# Altium project audiobound.PrjPcb
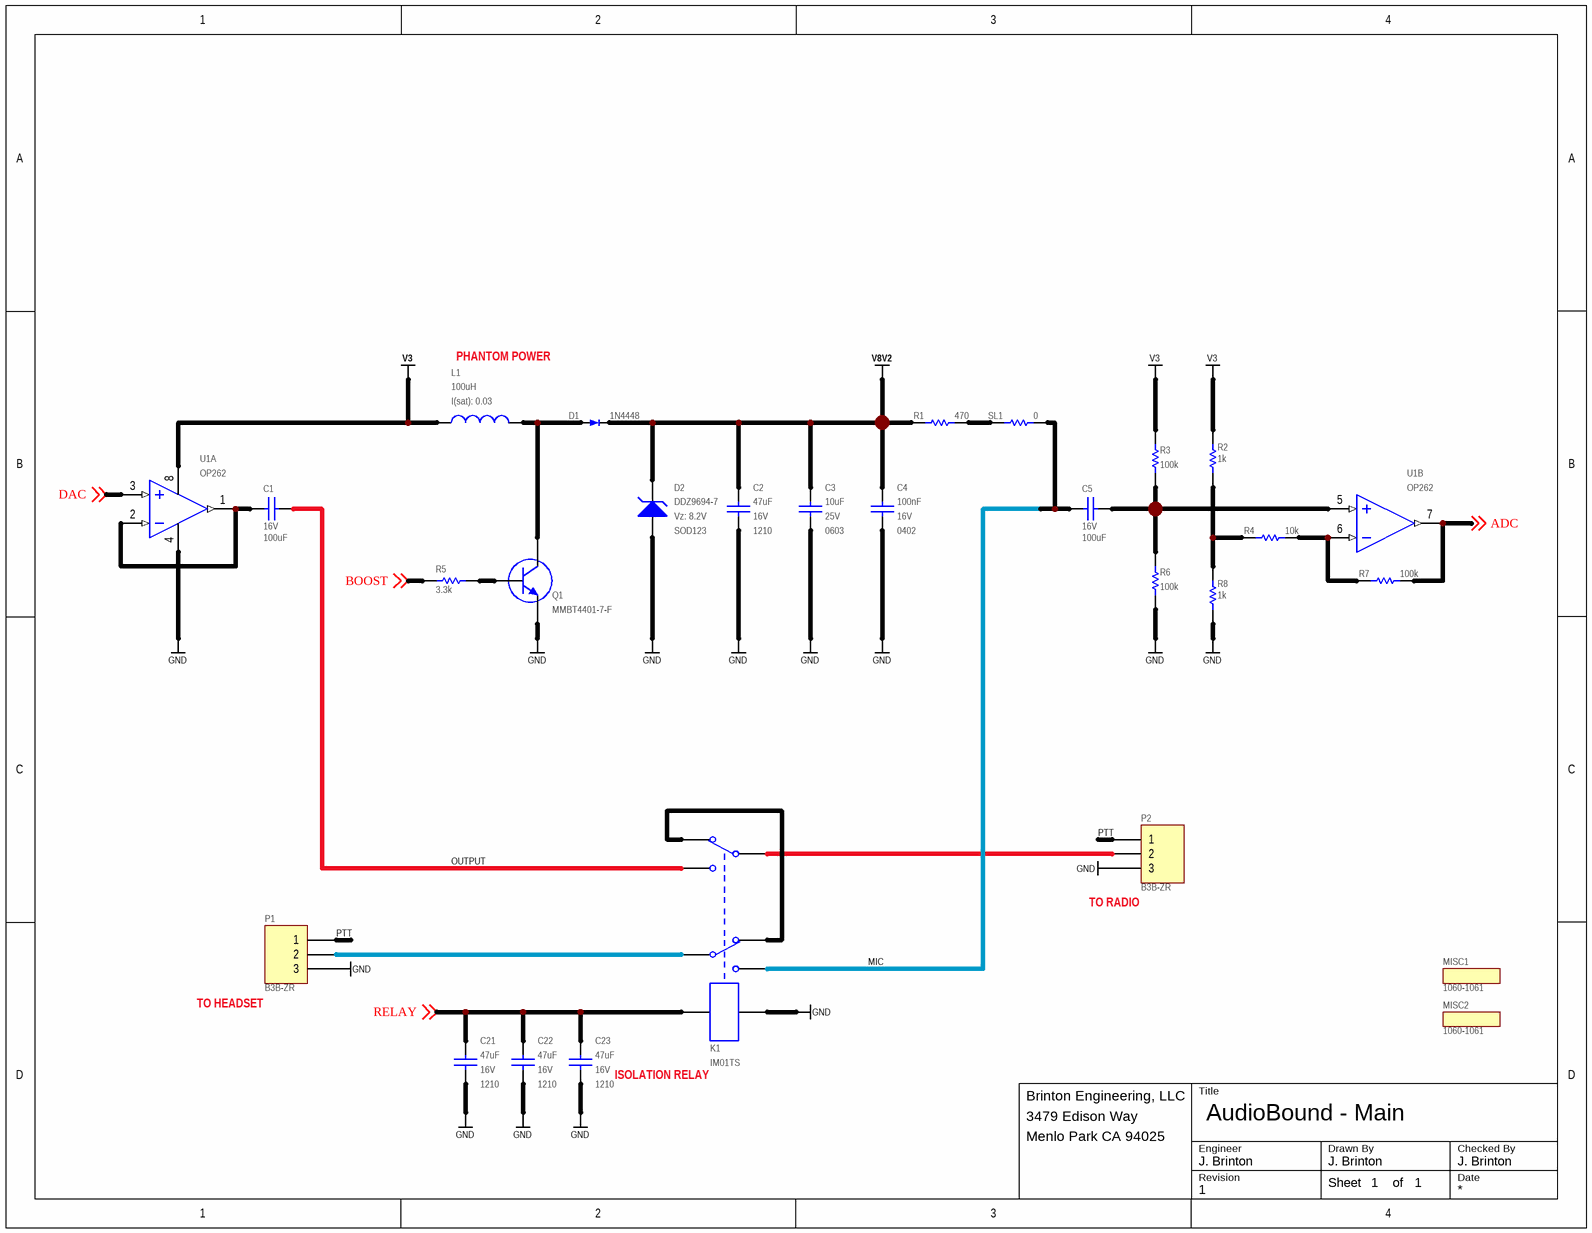
[diagram p0: main.SchDoc]
3 sheets, 81 parts. Net scope: global (net labels, ports and power ports of the same name join across sheets).
Board file: audiobound.PcbDoc
Sheets:
  main.SchDoc
  mcu.SchDoc
  power.SchDoc

## Sheet main.SchDoc: AudioBound - Main
size Letter; CheckedBy: J. Brinton; CompanyName: Brinton Engineering, LLC; DrawnBy: J. Brinton; Engineer: J. Brinton; Address1: 3479 Edison Way; Address2: Menlo Park CA 94025; Revision: 1; SheetNumber: 1; SheetTotal: 1

### Parts
C1  value 100uF  Voltage: 16V  [CAPC7563X300L40N]  (hidden comment: C7563X7S1C107M280LE)
C2  value 47uF  Voltage: 16V  [1210]  (hidden comment: GRM32EC81C476KE15L)
C3  value 10uF  Voltage: 25V  [0603]  (hidden comment: CL10A106MA8NRNC)
C4  value 100nF  Voltage: 16V  [0402]  (hidden comment: GRM155R71C104KA88J)
C5  value 100uF  Voltage: 16V  [CAPC7563X300L40N]  (hidden comment: C7563X7S1C107M280LE)
C21  value 47uF  Voltage: 16V  [1210]  (hidden comment: GRM32EC81C476KE15L)
C22  value 47uF  Voltage: 16V  [1210]  (hidden comment: GRM32EC81C476KE15L)
C23  value 47uF  Voltage: 16V  [1210]  (hidden comment: GRM32EC81C476KE15L)
D1  Alternative P/N: 1N4448  [SOD323]  (hidden comment: 1N4448HWS-7-F)
D2  DDZ9694-7  Vz: 8.2V  [SOD123]
K1  IM01TS  [IM01TS]
L1  value 100uH  I(sat): 0.03  [0805]  (hidden comment: KLZ2012NHR101LTD25)
MISC1  1060-1061  (mechanical)
MISC2  1060-1061  (mechanical)
P1  B3B-ZR  [B3B-ZR]  (no BOM)
P2  B3B-ZR  [B3B-ZR]  (no BOM)
Q1  MMBT4401-7-F  [SOT23]
R1  value 470  [RESC1005X40N]  (hidden comment: ERJ-2RKF4700X)
R2  value 1k  [RESC1005X40N]  (hidden comment: ERJ-2RKF1001X)
R3  value 100k  [RESC1005X40N]  (hidden comment: ERJ-2RKF1003X)
R4  value 10k  [RESC1005X40N]  (hidden comment: ERJ-2RKF1002X)
R5  value 3.3k  [RESC1005X40N]  (hidden comment: ERJ-2RKF3301X)
R6  value 100k  [RESC1005X40N]  (hidden comment: ERJ-2RKF1003X)
R7  value 100k  [RESC1005X40N]  (hidden comment: ERJ-2RKF1003X)
R8  value 1k  [RESC1005X40N]  (hidden comment: ERJ-2RKF1001X)
SL1  value 0  [SOLDERLINK0603X26N_BRIDGED]  (hidden comment: SOLDER_LINK_BRIDGED)  (no BOM)
U1  OP262  [TSSOP8]  (parts A,B of 2)

### Nets
GND: C2.1 C3.1 C4.2 C21.1 C22.1 C23.1 D2.1(A) K1.8 P1.3 P2.3 Q1.2(E) R6.1 R8.1 U1.4(V-)
V3: L1.1 R2.2 R3.2 U1.8(V+)
V8V2: C2.2 C3.2 C4.1 D1.K D2.2(C) R1.2
ADC: R7.1 U1.7(OUTB) ; off-sheet ADC
BOOST: R5.2 ; off-sheet BOOST
DAC: U1.3(INA+) ; off-sheet DAC
MIC: C5.2 K1.4 SL1.2
OUTPUT: C1.1 K1.5
PTT: P1.1 P2.1
RELAY: C21.2 C22.2 C23.2 K1.1 ; off-sheet RELAY
NetC1_2: C1.2 U1.1(OUTA) U1.2(INA-)
NetC5_1: C5.1 R3.1 R6.2 U1.5(INB+)
NetD1_A: D1.A L1.2 Q1.3(C)
NetK1_2: K1.2 K1.7
NetK1_3: K1.3 P1.2
NetK1_6: K1.6 P2.2
NetQ1_1: Q1.1(B) R5.1
NetR1_1: R1.1 SL1.1
NetR2_1: R2.1 R4.2 R8.2
NetR4_1: R4.1 R7.2 U1.6(INB-)

### Notes on the sheet
- PHANTOM POWER
- (near P2) TO RADIO
- (near P1) TO HEADSET
- ISOLATION RELAY
- Title
- Engineer
- Revision
- Drawn By
- Checked By
- Date
- Sheet
- of

### Library data of the parts
C1 C5 = CAP: Ceramic Capacitor 100uF ±20% 16V X7S 3025; Manufacturer: TDK; Tr: -55:125; Manufacturer P/N: C7563X7S1C107M280LE; Tolerance: ±20%; Package: 3025
C2 C21-C23 = CAP: Ceramic Capacitor 47uF ±10% 16V X6S 1210; Manufacturer: Murata; Tr: -55:105; Manufacturer P/N: GRM32EC81C476KE15L; Tolerance: ±10%; Footprint: *; Package: 1210
C3 = CAP 0603: Ceramic Capacitor 10uF ±20% 25V X5R 0603; Manufacturer: Samsung; Tr: -55:85; Manufacturer P/N: CL10A106MA8NRNC; Package: 0603; Tolerance: ±20%
C4 = CAP 0402: Ceramic Capacitor 100nF ±10% 16V X7R 0402; Manufacturer: Murata; Tr: -55:125; Manufacturer P/N: GRM155R71C104KA88J; Package: 0402; Tolerance: ±10%
D1 = 1N4448HWS-7-F: Schottky Diode 80V 250mA SOD323; Manufacturer: Diodes, Inc.; Manufacturer P/N: 1N4448HWS-7-F
D2 = DDZ9694-7: Zener Diode 8.2V 500mW SOD123; Manufacturer: Diodes, Inc.; Manufacturer P/N: DDZ9694-7; Package: SOD123
K1 = IM01TS: Dual-Pole Dual-Throw Relay; Manufacturer: TE Connectivity; Manufacturer: IM01TS
L1 = INDUCTOR: Inductor 100uH ±20% 140mA 0805; Manufacturer: TDK; Tr: -55:150; Manufacturer P/N: KLZ2012NHR101LTD25; Package: 0805; Tolerance: ±20%
MISC1 MISC2 = M50-1900005: Strain Relief Bushing; Manufacturer: Heyco; Do Not Place: PURCHASE BUT DNP; Manufacturer P/N: 1060-1061
P1 P2 = Header 3: Header, 3-Pin; Manufacturer: JST; Manufacturer P/N: B3B-ZR
Q1 = MMBT4401-7-F: NPN Small Signal Transistor SMD SOT-23; Manufacturer: Diodes, Inc.; Manufacturer P/N: MMBT4401-7-F
R1 = RES: Thick Film Resistor 470 ±1% 0.1W 50V 0402; Manufacturer: Panasonic; Tcr: ±100; Tr: -55:155; Voltage: 50; Power: 0.1; Manufacturer P/N: ERJ-2RKF4700X; Tolerance: ±1%; Alternatives: *; Footprint: *; Package: 0402
R2 R8 = RES: Thick Film Resistor 1k ±1% 0.1W 50V 0402; Manufacturer: Panasonic; Tcr: ±100; Tr: -55:155; Voltage: 50; Power: 0.1; Manufacturer P/N: ERJ-2RKF1001X; Tolerance: ±1%; Alternatives: *; Footprint: *; Package: 0402
R3 R6 R7 = RES: Thick Film Resistor 100k ±1% 0.1W 50V 0402; Manufacturer: Panasonic; Tcr: ±100; Tr: -55:155; Voltage: 50; Power: 0.1; Manufacturer P/N: ERJ-2RKF1003X; Tolerance: ±1%; Alternatives: *; Footprint: *; Package: 0402
R4 = RES: Thick Film Resistor 10k ±1% 0.1W 50V 0402; Manufacturer: Panasonic; Tcr: ±100; Tr: -55:155; Voltage: 50; Power: 0.1; Manufacturer P/N: ERJ-2RKF1002X; Tolerance: ±1%; Alternatives: *; Footprint: *; Package: 0402
R5 = RES: Thick Film Resistor 3.3k ±1% 0.1W 50V 0402; Manufacturer: Panasonic; Tcr: ±100; Tr: -55:155; Voltage: 50; Power: 0.1; Manufacturer P/N: ERJ-2RKF3301X; Tolerance: ±1%; Alternatives: *; Footprint: *; Package: 0402
SL1 = RES: Solder Link Bridged; Manufacturer P/N: *; Manufacturer: *
U1 = OP262: Dual 15 MHz Rail-to-Rail Op Amp; Manufacturer P/N: OP262HRU; Manufacturer: Analog Devices

## Sheet mcu.SchDoc: AudioBound - MCU
size Letter; CheckedBy: J. Brinton; CompanyName: Brinton Engineering, LLC; DrawnBy: J. Brinton; Engineer: J. Brinton; Address1: 3479 Edison Way; Address2: Menlo Park CA 94025; Revision: 1; SheetNumber: 2; SheetTotal: 2
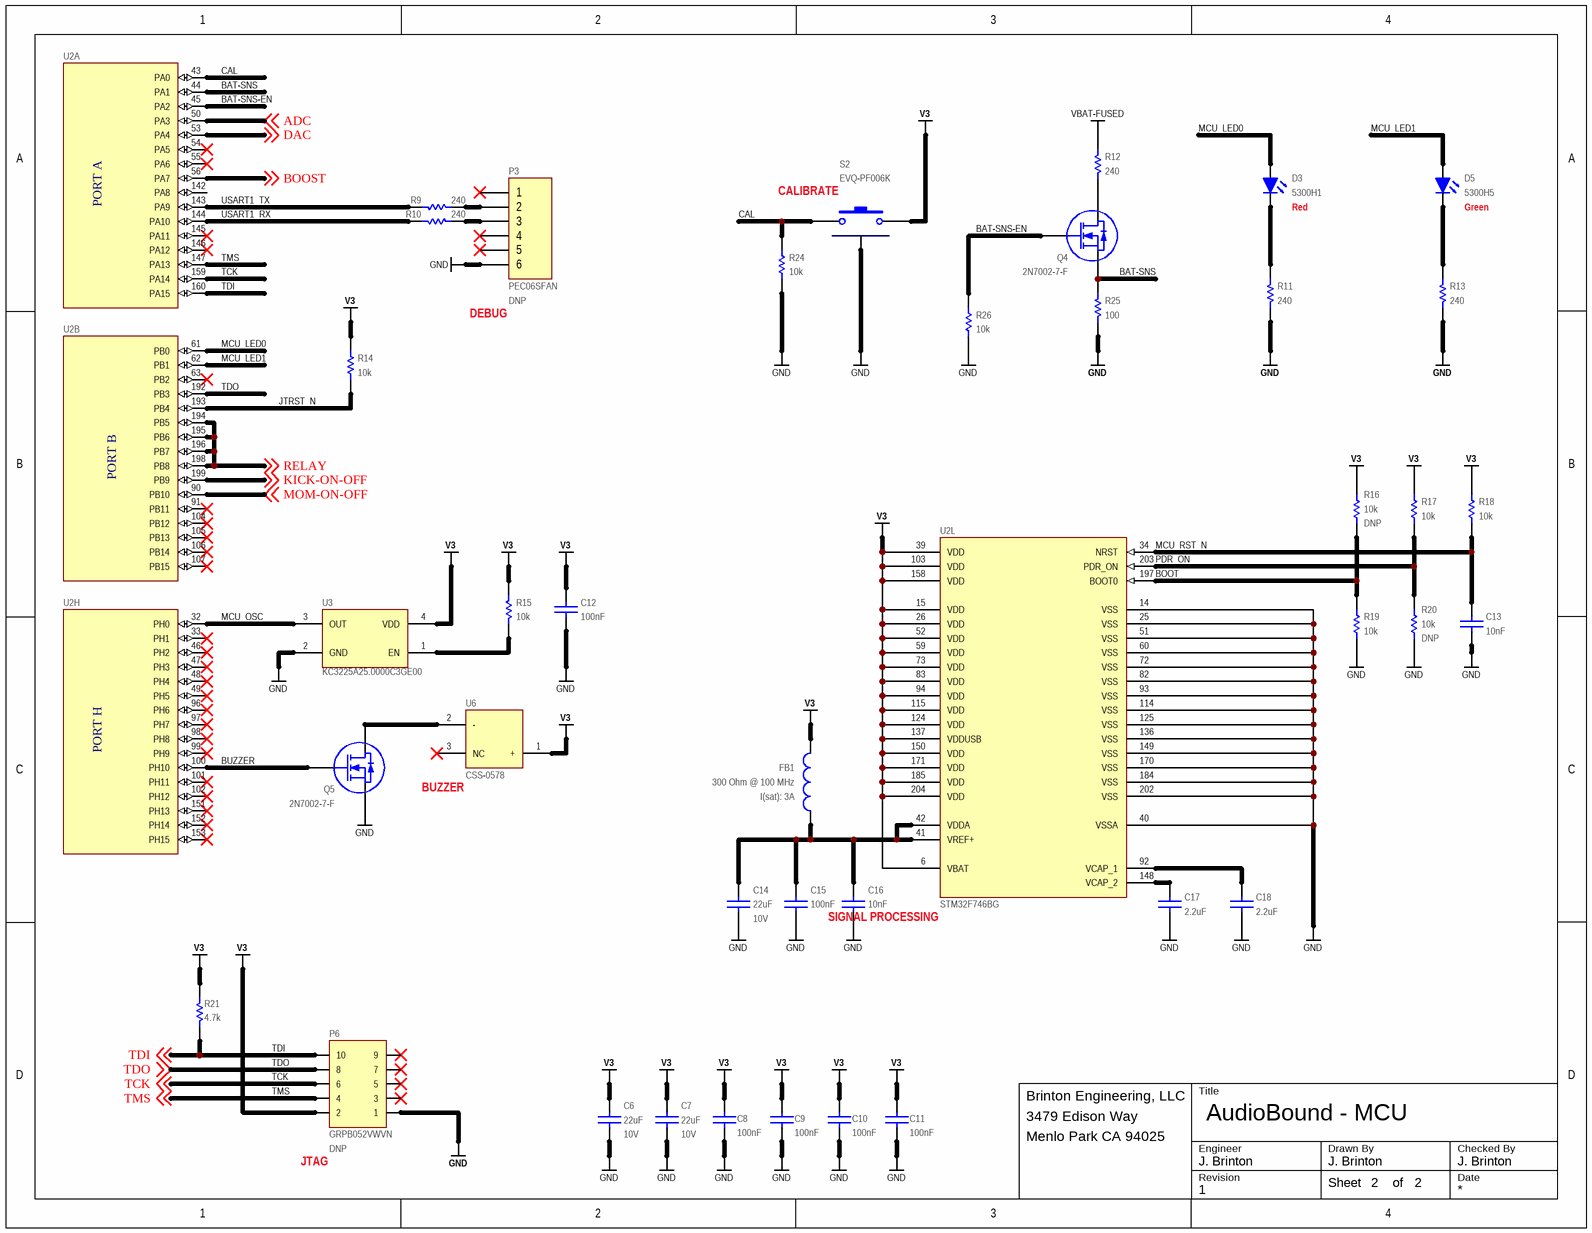
[diagram p1: mcu.SchDoc]

### Parts
C6  value 22uF  Voltage: 10V  [CAPC200X125X145L45N]  (hidden comment: C2012X7S1A226M125)
C7  value 22uF  Voltage: 10V  [CAPC200X125X145L45N]  (hidden comment: C2012X7S1A226M125)
C8  value 100nF  [CAPC100X50X55L25N]  (hidden comment: GCM155R71H104KE02)
C9  value 100nF  [CAPC100X50X55L25N]  (hidden comment: GCM155R71H104KE02)
C10  value 100nF  [CAPC100X50X55L25N]  (hidden comment: GCM155R71H104KE02)
C11  value 100nF  [CAPC100X50X55L25N]  (hidden comment: GCM155R71H104KE02)
C12  value 100nF  [CAPC100X50X55L25N]  (hidden comment: GCM155R71H104KE02)
C13  value 10nF  [CAPC100X50X55L25N]  (hidden comment: GRM155R71H103KA88)
C14  value 22uF  Voltage: 10V  [CAPC200X125X145L45N]  (hidden comment: C2012X7S1A226M125)
C15  value 100nF  [CAPC100X50X55L25N]  (hidden comment: GCM155R71H104KE02)
C16  value 10nF  [CAPC100X50X55L25N]  (hidden comment: GRM155R71H103KA88)
C17  value 2.2uF  [CAPC160X80X90L20N]  (hidden comment: C1608X7R1A225M080)
C18  value 2.2uF  [CAPC160X80X90L20N]  (hidden comment: C1608X7R1A225M080)
D3  5300H1  [5300Hx]
D5  5300H5  [5300Hx]
FB1  value 300 Ohm @ 100 MHz  I(sat): 3A  [0805]  (hidden comment: 742792031)
P3  PEC06SFAN  Do Not Place: DNP  [HDR1X6]
P6  GRPB052VWVN  Do Not Place: DNP  [GRPB052VWVN]
Q4  2N7002-7-F  [SOT23]
Q5  2N7002-7-F  [SOT23]
R9  value 240  [RESC1005X40N]  (hidden comment: ERJ-2RKF2400X)
R10  value 240  [RESC1005X40N]  (hidden comment: ERJ-2RKF2400X)
R11  value 240  [RESC1005X40N]  (hidden comment: ERJ-2RKF2400X)
R12  value 240  [RESC1005X40N]  (hidden comment: ERJ-2RKF2400X)
R13  value 240  [RESC1005X40N]  (hidden comment: ERJ-2RKF2400X)
R14  value 10k  [RESC1005X40N]  (hidden comment: ERJ-2RKF1002X)
R15  value 10k  [RESC1005X40N]  (hidden comment: ERJ-2RKF1002X)
R16  value 10k  Do Not Place: DNP  [RESC1005X40N]  (hidden comment: ERJ-2RKF1002X)
R17  value 10k  [RESC1005X40N]  (hidden comment: ERJ-2RKF1002X)
R18  value 10k  [RESC1005X40N]  (hidden comment: ERJ-2RKF1002X)
R19  value 10k  [RESC1005X40N]  (hidden comment: ERJ-2RKF1002X)
R20  value 10k  Do Not Place: DNP  [RESC1005X40N]  (hidden comment: ERJ-2RKF1002X)
R21  value 4.7k  [RESC1005X40N]  (hidden comment: ERJ-2RKF4701X)
R24  value 10k  [RESC1005X40N]  (hidden comment: ERJ-2RKF1002X)
R25  value 100  [RESC1005X40N]  (hidden comment: ERJ-2RKF1000X)
R26  value 10k  [RESC1005X40N]  (hidden comment: ERJ-2RKF1002X)
S2  EVQ-PF006K  [EVQ-PF006K]
U2  STM32F746BG  [LQFP208]  (value not drawn)  (parts A,B,H,L of 12)
U3  KC3225A25.0000C3GE00  [OSCCC320X250X80L75X100N]
U6  CSS-0578  [CSS-0578]

### Nets
GND: C6.2 C7.2 C8.1 C9.1 C10.1 C11.1 C12.1 C13.1 C14.2 C15.1 C16.1 C17.1 C18.1 P3.6 P6.1 Q5.2(S) R11.2 R13.2 R19.1 R20.1 R24.2 R25.2 R26.2 S2.3 U2.14(VSS) U2.25(VSS) U2.40(VSSA) U2.51(VSS) U2.60(VSS) U2.72(VSS) U2.82(VSS) U2.93(VSS) U2.114(VSS) U2.125(VSS) U2.136(VSS) U2.149(VSS) U2.170(VSS) U2.184(VSS) U2.202(VSS) U3.2(GND)
V3: C6.1 C7.1 C8.2 C9.2 C10.2 C11.2 C12.2 FB1.2 P6.2 R14.2 R15.2 R16.2 R17.2 R18.2 R21.2 S2.2 U2.6(VBAT) U2.15(VDD) U2.26(VDD) U2.39(VDD) U2.52(VDD) U2.59(VDD) U2.73(VDD) U2.83(VDD) U2.94(VDD) U2.103(VDD) U2.115(VDD) U2.124(VDD) U2.137(VDDUSB) U2.150(VDD) U2.158(VDD) U2.171(VDD) U2.185(VDD) U2.204(VDD) U3.4(VDD) U6.1(+)
VBAT-FUSED: R12.1
ADC: U2.50(PA3) ; off-sheet ADC
BAT-SNS: Q4.2(S) R25.1 U2.44(PA1)
BAT-SNS-EN: Q4.1(G) R26.1 U2.45(PA2)
BOOST: U2.56(PA7) ; off-sheet BOOST
BOOT: R16.1 R19.2 U2.197(BOOT0)
BUZZER: Q5.1(G) U2.100(PH10)
CAL: R24.1 S2.1 U2.43(PA0)
DAC: U2.53(PA4) ; off-sheet DAC
JTRST_N: R14.1 U2.193(PB4)
KICK-ON-OFF: U2.199(PB9) ; off-sheet KICK-ON-OFF
MCU_LED0: D3.1(A) U2.61(PB0)
MCU_LED1: D5.1(A) U2.62(PB1)
MCU_OSC: U2.32(PH0) U3.3(OUT)
MCU_RST_N: C13.2 R18.1 U2.34(NRST)
MOM-ON-OFF: U2.90(PB10) ; off-sheet MOM-ON-OFF
PDR_ON: R17.1 R20.2 U2.203(PDR_ON)
RELAY: U2.194(PB5) U2.195(PB6) U2.196(PB7) U2.198(PB8) ; off-sheet RELAY
TCK: P6.6 U2.159(PA14) ; off-sheet TCK
TDI: P6.10 R21.1 U2.160(PA15) ; off-sheet TDI
TDO: P6.8 U2.192(PB3) ; off-sheet TDO
TMS: P6.4 U2.147(PA13) ; off-sheet TMS
USART1_RX: R10.1 U2.144(PA10)
USART1_TX: R9.1 U2.143(PA9)
NetC14_1: C14.1 C15.2 C16.2 FB1.1 U2.41(VREF+) U2.42(VDDA)
NetC17_2: C17.2 U2.148(VCAP_2)
NetC18_2: C18.2 U2.92(VCAP_1)
NetD3_2: D3.2(K) R11.1
NetD5_2: D5.2(K) R13.1
NetP3_2: P3.2 R9.2
NetP3_3: P3.3 R10.2
NetQ4_3: Q4.3(D) R12.2
NetQ5_3: Q5.3(D) U6.2(-)
NetR15_1: R15.1 U3.1(EN)

Not connected (* = marked no-connect by the designer): P3 1* 4* 5*; P6 3* 5* 7* 9*; U2 33(PH1)* 46(PH2)* 47(PH3)* 48(PH4)* 49(PH5)* 54(PA5)* 55(PA6)* 63(PB2)* 91(PB11)* 96(PH6)* 97(PH7)* 98(PH8)* 99(PH9)* 101(PH11)* 102(PH12)* 104(PB12)* 105(PB13)* 106(PB14)* 107(PB15)* 142(PA8) 145(PA11)* 146(PA12)* 151(PH13)* 152(PH14)* 153(PH15)*; U6 3(NC)*

### Notes on the sheet
- (near S2) CALIBRATE
- (near D3) Red
- (near D5) Green
- (near P3) DEBUG
- (near U6) BUZZER
- (near U2) SIGNAL PROCESSING
- (near P6) JTAG
- Title
- Engineer
- Revision
- Drawn By
- Checked By
- Date
- Sheet
- of
- (in symbol STM32F746BGT6, part A) PORT A
- (in symbol STM32F746BGT6, part B) PORT B
- (in symbol STM32F746BGT6, part H) PORT H

### Library data of the parts
C6 C7 C14 = CAP: Ceramic Capacitor 22uF ±20% 10V X7S 0805; Manufacturer: TDK; Tr: -55:125; Manufacturer P/N: C2012X7S1A226M125; Tolerance: ±20%; Package: 0805
C8-C12 C15 = CAP: Ceramic Capacitor 100nF ±10% 50V X7R 0402; Manufacturer: Murata; Tr: -55:125; Voltage: 50V; Manufacturer P/N: GCM155R71H104KE02; Tolerance: ±10%; Footprint: *; Package: 0402
C13 C16 = CAP: Ceramic Capacitor 10nF ±10% 50V X7R 0402; Manufacturer: Murata; Tr: -55:125; Tolerance: ±10%; Manufacturer P/N: GRM155R71H103KA88; Voltage: 50V; Package: 0402
C17 C18 = CAP: Ceramic Capacitor 2.2uF ±20% 10V X7R 0603; Manufacturer: TDK; Tr: -55:125; Tolerance: ±20%; Manufacturer P/N: C1608X7R1A225M080; Package: 0603; Voltage: 10V
D3 = LED0603RD: LED, Color Red, 10mA, 2.0V; Manufacturer: Visual Communications Company; Manufacturer P/N: 5300H1
D5 = LED0603RD: LED, Color Green, 10mA, 2.2V; Manufacturer: Visual Communications Company; Manufacturer P/N: 5300H5
FB1 = INDUCTOR: Ferrite Chip 300 Ohm @ 100MHz; 3A; Manufacturer: Wurth Electronics, Inc; Manufacturer P/N: 742792031; Package: 0805
P3 = Header 6: Header, 6-Pin; Manufacturer: Sullins; Manufacture P/N: PEC06SFAN
P6 = GRPB052VWVN: Male Header, 0.050" Pitch, 2x5 Position, Right Angle; Manufacturer P/N: GRPB052MWCN; Manufacturer: Sullins
Q4 Q5 = 2N7002-7-F: N-Channel Enhancement Mode MOSFET; Manufacturer: Diodes, Inc.; Manufacturer P/N: 2N7002-7-F
R9-R13 = RES: Thick Film Resistor 240 ±1% 0.1W 75V 0402; Manufacturer: Panasonic; Tcr: ±100; Tr: -55:155; Voltage: 75; Power: 0.1; Tolerance: ±1%; Manufacturer P/N: ERJ-2RKF2400X; Alternatives: *; Footprint: *; Package: 0402
R14-R20 R24 R26 = RES: as R4 on sheet main; Manufacturer P/N: ERJ-2RKF1002X; Tolerance: ±1%; Alternatives: *; Footprint: *; Package: 0402
R21 = RES: Thick Film Resistor 4.7k ±1% 0.1W 75V 0402; Manufacturer: Panasonic; Tcr: ±100; Tr: -55:155; Voltage: 75; Power: 0.1; Tolerance: ±1%; Manufacturer P/N: ERJ-2RKF4701X; Alternatives: *; Footprint: *; Package: 0402
R25 = RES: Thick Film Resistor 100 ±1% 0.1W 75V 0402; Manufacturer: Panasonic; Tcr: ±100; Tr: -55:155; Voltage: 75; Power: 0.1; Tolerance: ±1%; Manufacturer P/N: ERJ-2RKF1000X; Alternatives: *; Footprint: *; Package: 0402
S2 = EVQ-PF006K: Tactile Switch; Normally Open; Manufacturer: Panasonic; Manufacturer P/N: EVQ-PF006K
U2 = STM32F746BGT6: STM32 Microcontroller; Manufacturer: ST Microelectronics; Manufacturer P/N: STM32F746BG
U3 = OSC_25M_NZ2520SB: Oscillator 25.00Mhz, -+50PPM, 3.3V; Manufacturer: Kyocera; Manufacturer P/N: KC3225A25.0000C3GE00
U6 = CSS-0578: Magnetic Buzzer; Manufacturer: CUI; Manufacturer P/N: CSS-0578

## Sheet power.SchDoc: AudioBound - Power
size Letter; CheckedBy: J. Brinton; CompanyName: Brinton Engineering, LLC; DrawnBy: J. Brinton; Engineer: J. Brinton; Address1: 3479 Edison Way; Address2: Menlo Park CA 94025; Revision: 1; SheetNumber: 3; SheetTotal: 3
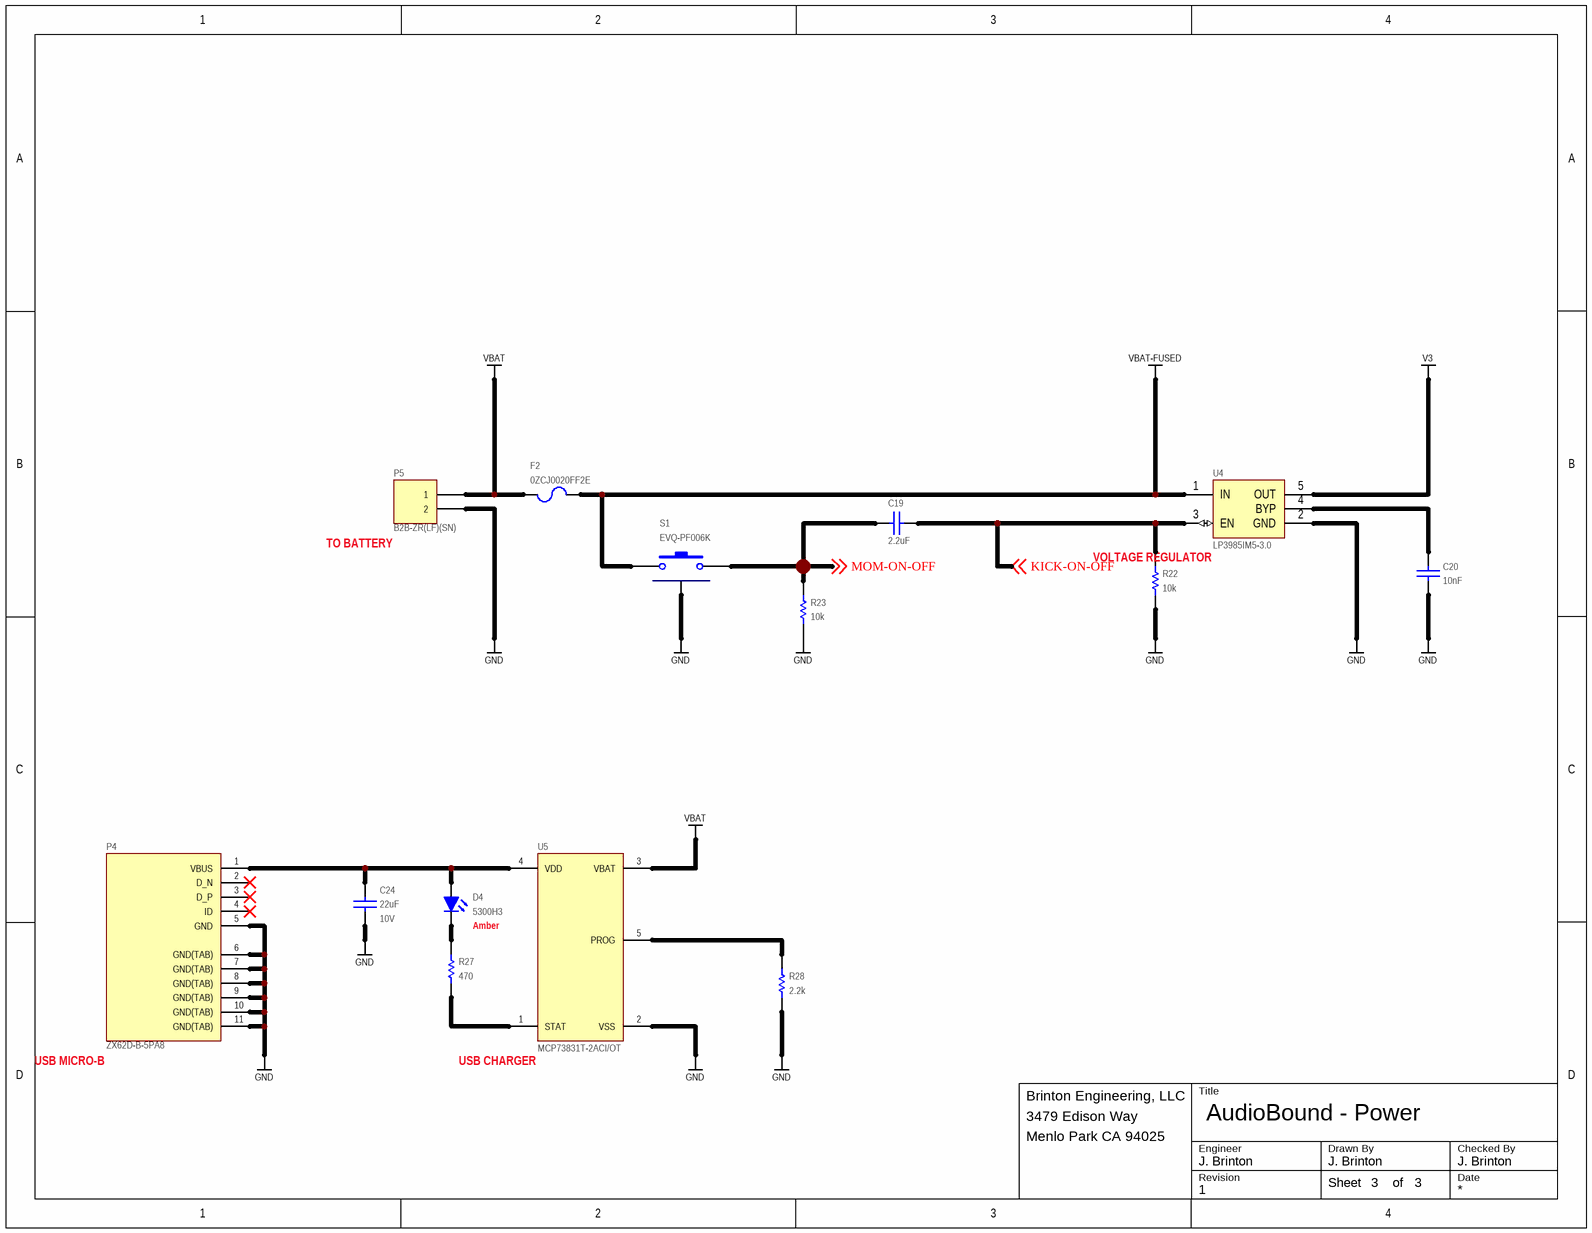
[diagram p2: power.SchDoc]

### Parts
C19  value 2.2uF  [CAPC160X80X90L20N]  (hidden comment: C1608X7R1A225M080)
C20  value 10nF  [CAPC100X50X55L25N]  (hidden comment: GRM155R71H103KA88)
C24  value 22uF  Voltage: 10V  [CAPC200X125X145L45N]  (hidden comment: C2012X7S1A226M125)
D4  5300H3  [5300Hx]
F2  0ZCJ0020FF2E  [1206]
P4  ZX62D-B-5PA8  [ZX62D-B-5PA8]
P5  B2B-ZR(LF)(SN)  [B2B-ZR]
R22  value 10k  [RESC1005X40N]  (hidden comment: ERJ-2RKF1002X)
R23  value 10k  [RESC1005X40N]  (hidden comment: ERJ-2RKF1002X)
R27  value 470  [RESC1005X40N]  (hidden comment: ERJ-2RKF4700X)
R28  value 2.2k  [RESC1005X40N]  (hidden comment: ERJ-2RKF2201X)
S1  EVQ-PF006K  [EVQ-PF006K]
U4  LP3985IM5-3.0  [DBV-5]
U5  MCP73831T-2ACI/OT  [SOT23-5]

### Nets
GND: C20.1 C24.2 P4.5(GND) P4.6(GND(TAB)) P4.7(GND(TAB)) P4.8(GND(TAB)) P4.9(GND(TAB)) P4.10(GND(TAB)) P4.11(GND(TAB)) P5.2 R22.1 R23.2 R28.2 S1.3 U4.2(GND) U5.2(VSS)
V3: U4.5(OUT)
VBAT: F2.2 P5.1 U5.3(VBAT)
VBAT-FUSED: F2.1 S1.1 U4.1(IN)
KICK-ON-OFF: C19.1 R22.2 U4.3(EN) ; off-sheet KICK-ON-OFF
MOM-ON-OFF: C19.2 R23.1 S1.2 ; off-sheet MOM-ON-OFF
NetC20_2: C20.2 U4.4(BYP)
NetC24_1: C24.1 D4.1(A) P4.1(VBUS) U5.4(VDD)
NetD4_2: D4.2(K) R27.1
NetR27_2: R27.2 U5.1(STAT)
NetR28_1: R28.1 U5.5(PROG)

Not connected (* = marked no-connect by the designer): P4 2(D_N)* 3(D_P)* 4(ID)*

### Notes on the sheet
- (near P5) TO BATTERY
- (near U4) VOLTAGE REGULATOR
- Amber
- (near P4) USB MICRO-B
- (near U5) USB CHARGER
- Title
- Engineer
- Revision
- Drawn By
- Checked By
- Date
- Sheet
- of

### Library data of the parts
C19 = CAP: as C17 on sheet mcu; Tolerance: ±20%; Manufacturer P/N: C1608X7R1A225M080; Package: 0603; Voltage: 10V
C20 = CAP: as C13 on sheet mcu; Tolerance: ±10%; Manufacturer P/N: GRM155R71H103KA88; Voltage: 50V; Package: 0402
C24 = CAP: as C6 on sheet mcu; Manufacturer P/N: C2012X7S1A226M125; Tolerance: ±20%; Package: 0805
D4 = LED0603RD: LED, Color Amber, 10mA, 2.0V; Manufacturer: Visual Communications Company; Manufacturer P/N: 5300H3
F2 = 0ZCJ0020FF2E: PTC Resettable Fuse, 0.2A, 30V, SMD 1206; Manufacturer: Bell Fuse; Manufacturer P/N: 0ZCJ0020FF2E
P4 = ZX62D-B-5PA8: USB Micro-B SMD Connector; Manufacturer: Hirose; Manufacturer P/N: ZX62D-B-5PA8
P5 = Header 2: Header, 2-Pin; Manufacturer: JST; Manufacturer P/N: B2B-ZR(LF)(SN)
R22 R23 = RES: as R4 on sheet main; Manufacturer P/N: ERJ-2RKF1002X; Tolerance: ±1%; Alternatives: *; Footprint: *; Package: 0402
R27 = RES: as R1 on sheet main; Manufacturer P/N: ERJ-2RKF4700X; Tolerance: ±1%; Alternatives: *; Footprint: *; Package: 0402
R28 = RES: Thick Film Resistor 2.2k ±1% 0.1W 50V 0402; Manufacturer: Panasonic; Tcr: ±100; Tr: -55:155; Voltage: 50; Power: 0.1; Manufacturer P/N: ERJ-2RKF2201X; Tolerance: ±1%; Alternatives: *; Footprint: *; Package: 0402
S1 = EVQ-PF006K: as S2 on sheet mcu; Manufacturer P/N: EVQ-PF006K
U4 = LP3985IM5-2.5: Low Dropout Regulator, Fixed, 150mA, 30uV Low Noise, 3.0V; Manufacturer: Texas Instruments; Manufacturer P/N: LP3985IM5-3.0; Voltage: 3.0V
U5 = MCP73831T-2ACI/OT: Single-Cell LiPo Charger; Manufacturer: Microchip; Manufacturer P/N: MCP73831T-2ACI/OT

## Nets that join several sheets
GND: main (14 pins), mcu (40 pins), power (16 pins)
V3: main (L1.1 R2.2 R3.2 U1.8), mcu (36 pins), power (U4.5)
VBAT-FUSED: mcu (R12.1), power (F2.1 S1.1 U4.1)
ADC: main (R7.1 U1.7), mcu (U2.50)
BOOST: main (R5.2), mcu (U2.56)
DAC: main (U1.3), mcu (U2.53)
KICK-ON-OFF: mcu (U2.199), power (C19.1 R22.2 U4.3)
MOM-ON-OFF: mcu (U2.90), power (C19.2 R23.1 S1.2)
RELAY: main (C21.2 C22.2 C23.2 K1.1), mcu (U2.194 U2.195 U2.196 U2.198)